# Altium schematic sheet StepDown.SchDoc
size B; SheetNumber: 10; SheetTotal: 15; SPICEModelCacheKQMKTCIF: <root> / <DocumentId>KQMKTCIF</DocumentId> / </root>
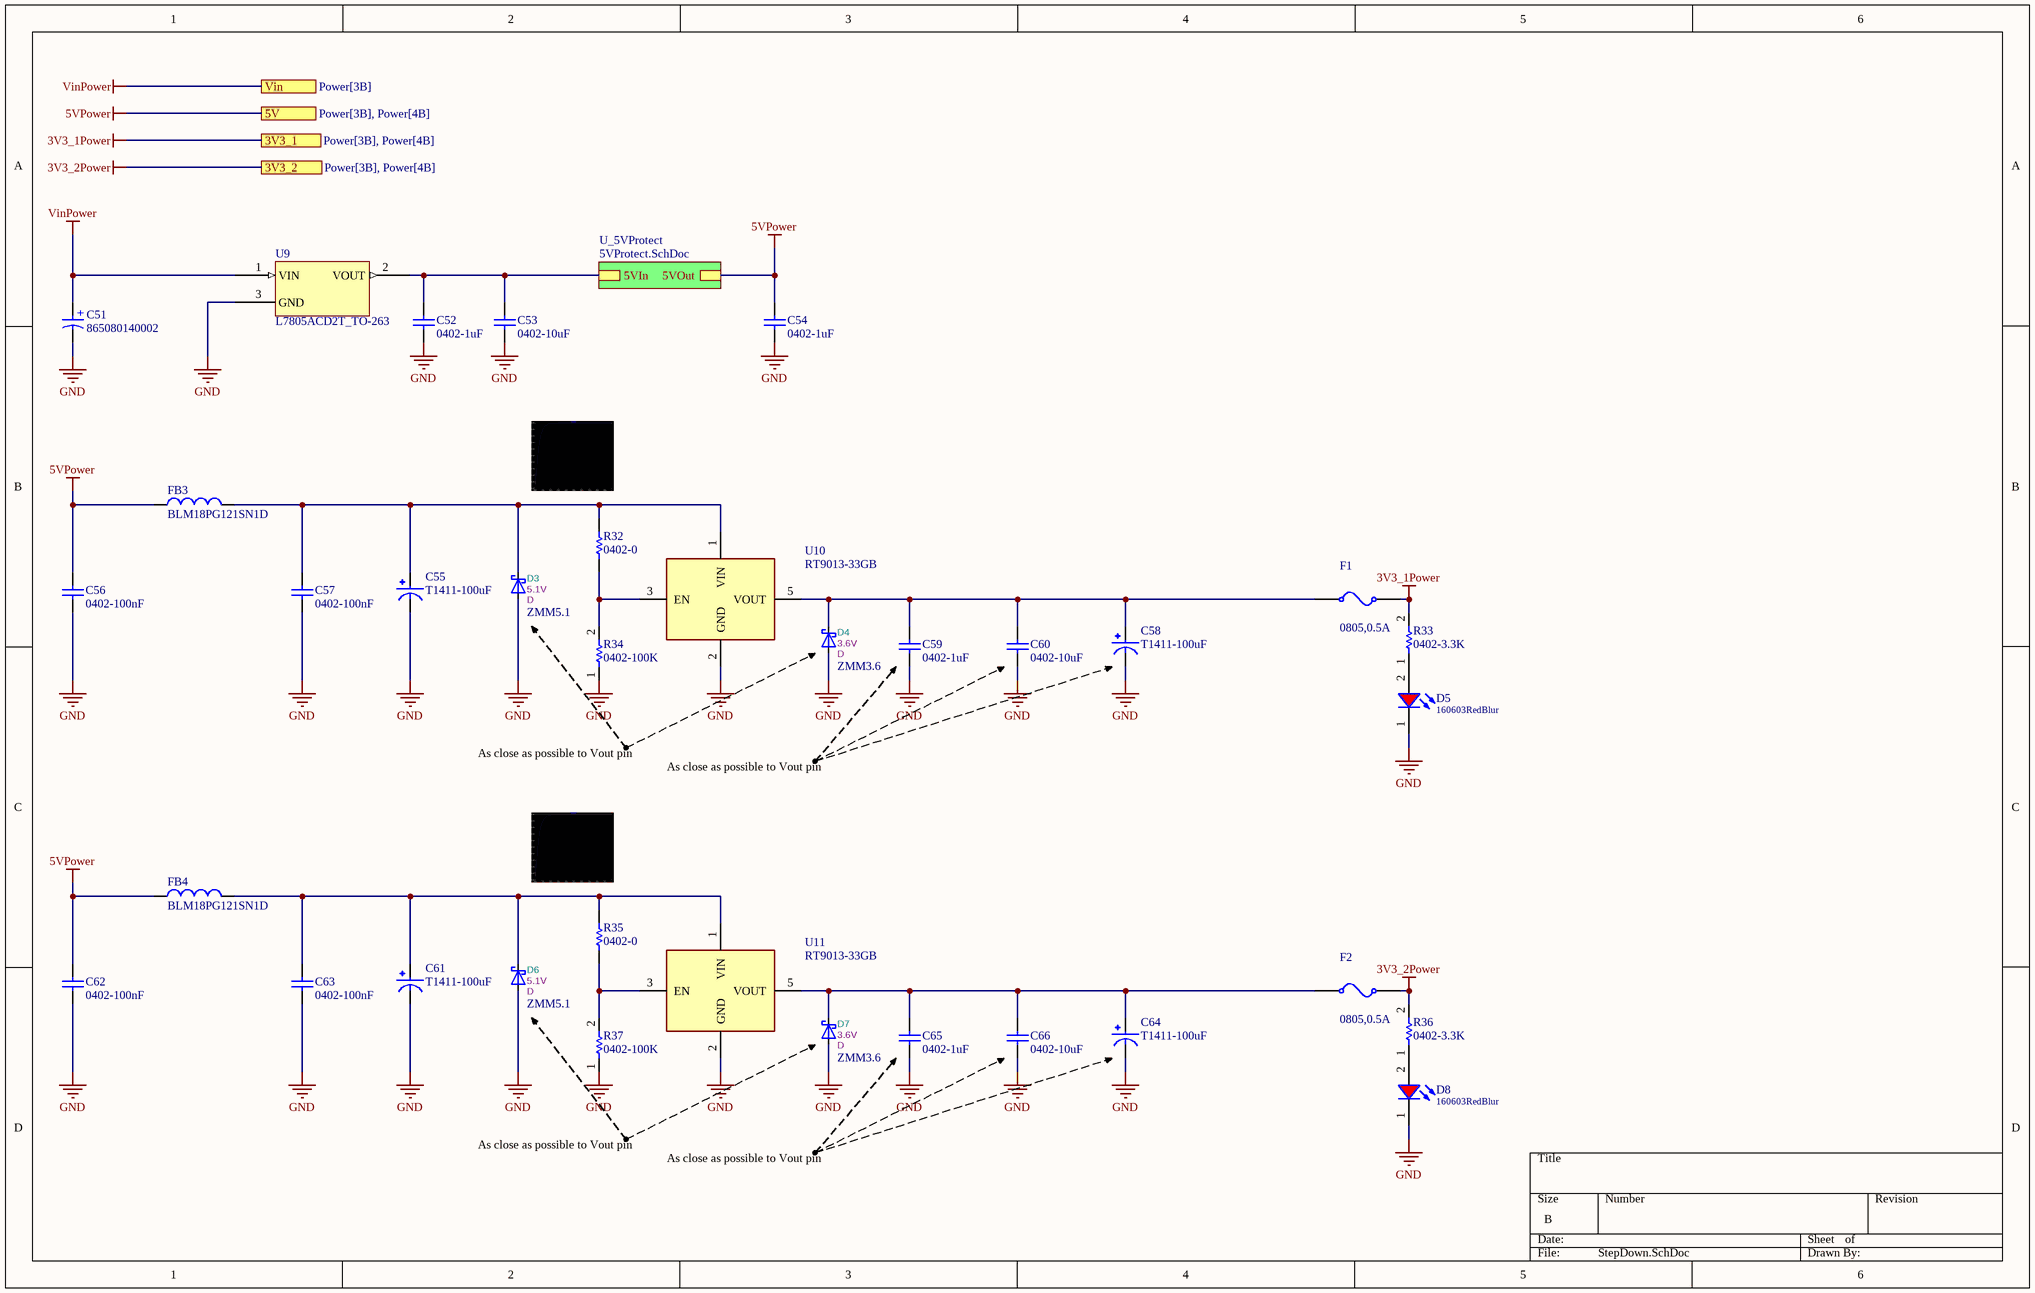
[diagram p0: StepDown.SchDoc]

## Parts
C51  865080140002  [WCAP-ASLI_D4H5.5]
C52  0402-1uF  [CAPC0402(1005)60_N]
C53  0402-10uF  [CAPC0402(1005)60_N]
C54  0402-1uF  [CAPC0402(1005)60_N]
C55  T1411-100uF  [CAPPC3528X210N]
C56  0402-100nF  [CAPC0402(1005)60_N]
C57  0402-100nF  [CAPC0402(1005)60_N]
C58  T1411-100uF  [CAPPC3528X210N]
C59  0402-1uF  [CAPC0402(1005)60_N]
C60  0402-10uF  [CAPC0402(1005)60_N]
C61  T1411-100uF  [CAPPC3528X210N]
C62  0402-100nF  [CAPC0402(1005)60_N]
C63  0402-100nF  [CAPC0402(1005)60_N]
C64  T1411-100uF  [CAPPC3528X210N]
C65  0402-1uF  [CAPC0402(1005)60_N]
C66  0402-10uF  [CAPC0402(1005)60_N]
D3  ZMM5.1  value 5.1V  Reference: D  [SOD-80_MiniMELF_Glass]
D4  ZMM3.6  value 3.6V  Reference: D  [SOD-80_MiniMELF_Glass]
D5  160603RedBlur  [WL-SMCW_0603_H=0.7mm]
D6  ZMM5.1  value 5.1V  Reference: D  [SOD-80_MiniMELF_Glass]
D7  ZMM3.6  value 3.6V  Reference: D  [SOD-80_MiniMELF_Glass]
D8  160603RedBlur  [WL-SMCW_0603_H=0.7mm]
F1  0805,0.5A  [Fuse_SMD_0805]
F2  0805,0.5A  [Fuse_SMD_0805]
FB3  BLM18PG121SN1D  [FP-BLM18-0_15-t0_8-MFG]
FB4  BLM18PG121SN1D  [FP-BLM18-0_15-t0_8-MFG]
R32  0402-0  [R-0402-1K]
R33  0402-3.3K  [R-0402-10K]
R34  0402-100K  [R-0402-10K]
R35  0402-0  [R-0402-1K]
R36  0402-3.3K  [R-0402-10K]
R37  0402-100K  [R-0402-10K]
U9  L7805ACD2T_TO-263  [TO-263]
U10  RT9013-33GB  [SOT94P279X129-5N]
U11  RT9013-33GB  [SOT94P279X129-5N]

## Sub-sheets
U_5VProtect = 5VProtect.SchDoc: 5VIn, 5VOut

## Ports
3V3_1 (see Power[3B], Power[4B]), 3V3_2 (see Power[3B], Power[4B]), 5V (see Power[3B], Power[4B]), Vin (see Power[3B])

## Nets
3V3_1Power: F1.1 R33.2 ; port 3V3_1
3V3_2Power: F2.1 R36.2 ; port 3V3_2
5VPower: C54.2 C56.2 C62.2 FB3.1 FB4.1 ; port 5V, sheet U_5VProtect/5VOut
GND: C51.2(N) C52.1 C53.1 C54.1 C55.2 C56.1 C57.1 C58.2 C59.1 C60.1 C61.2 C62.1 C63.1 C64.2 C65.1 C66.1 D3.A D4.A D5.1(K) D6.A D7.A D8.1(K) R34.1 R37.1 U9.3(GND) U10.2(GND) U11.2(GND)
VinPower: C51.1(P) U9.1(VIN) ; port Vin
NetC52_2: C52.2 C53.2 U9.2(VOUT) ; sheet U_5VProtect/5VIn
NetC55_1: C55.1 C57.2 D3.K FB3.2 R32.2 U10.1(VIN)
NetC58_1: C58.1 C59.2 C60.2 D4.K F1.0 U10.5(VOUT)
NetC61_1: C61.1 C63.2 D6.K FB4.2 R35.2 U11.1(VIN)
NetC64_1: C64.1 C65.2 C66.2 D7.K F2.0 U11.5(VOUT)
NetD5_2: D5.2(A) R33.1
NetD8_2: D8.2(A) R36.1
NetR32_1: R32.1 R34.2 U10.3(EN)
NetR35_1: R35.1 R37.2 U11.3(EN)

## Notes on the sheet
- As close as possible to Vout pin
- (in symbol CMP-014-00008-1) +

## Library data of the parts
C51 = CMP-014-00008-1: V-Chip, D4 x H5.8mm, 47uF, 6.3V; Manufacturer: Wurth Elektronik; Endurance: 2000h; Leakage Current: 3uA; Ripple Current: 86mA; Dissipation Factor: 24%; Capacitance Tolerance: +/-20%; Capacitance: 47µF; Pins: 2; Supplier 2 URL: N/A; Diameter: 4mm; Design Item ID: 865080140002; Supplier 1 SN: 710-865080140002; Operating Temperature Max: 105°C; Supplier 1 Name: Mouser; Source: Al_Cap.SchLib; Packaging: Tape and Reel; Supplier 2 Name: Digi-Key; Supplier 3 Name: thegioiic; Manufacturer Part Number: N/A; Supplier 2 SN: N/A; Rated Voltage (DC): 6.3V; Height: 5.5mm; Operating Temperature Min: -55°C; Value: 47uF, 6.3V; Supplier 1 URL: https://www.mouser.vn/ProductDetail/Wurth-Elektronik/865080140002?qs=0KOYDY2FL2%252BjKlezJ2boQA%3D%3D; Supplier 3 URL: https://www.thegioiic.com/tu-nhom-smd-47uf-6-3v-5x5-4mm; Category: Aluminum Electrolytic Capacitors; Mount: Surface Mount; Supplier 3 SN: EEEHB0J330AR; Component Type: Standard
C52 C54 C59 C65 = CMP-001-00353-3: Capacitor 1uF 0402s; Voltage Rating: 4V; Value: 1µF; Tolerance: 20%; Dielectric: X5R; Pins: 2; Component Type: Standard; Packaging: Tape and Reel; Min Operating Temperature: -55°C; Voltage Rating (DC): 4V; Series: M; Height: 0.5mm; RoHS Compliant: Yes; Case/Package: 0402; Thickness: 0.028inch; Design Item ID: CMP-1034-02139-2; Length: 0.039inch; Max Operating Temperature: 85°C; Termination: SMD/SMT; Package Quantity: 1; Width: 0.02inch; Halogen Free: Halogen Free; Source: 0402-10uF.SchLib; Construction: Flat; Mount: Surface Mount; Case Code (Metric): 1005
C53 C60 C66 = CMP-001-00352-3: Capacitor 10uF 0402s; Tolerance: 20%; Value: 10µF; Dielectric: X5R; Voltage Rating (DC): 4V; Width: 0.02inch; Packaging: Tape and Reel; RoHS Compliant: Yes; Series: M; Mount: Surface Mount; Termination: SMD/SMT; Source: 0402-10uF.SchLib; Design Item ID: CMP-1034-02139-2; Min Operating Temperature: -55°C; Construction: Flat; Component Type: Standard; Case Code (Metric): 1005; Length: 0.039inch; Height: 0.5mm; Pins: 2; Thickness: 0.028inch; Voltage Rating: 4V; Package Quantity: 1; Max Operating Temperature: 85°C; Halogen Free: Halogen Free; Case/Package: 0402
C55 C58 C61 C64 = CMP-001-00373-1: 100µF Molded Tantalum Polymer Capacitor 25 V 1411 (3528 Metric), 1210 150mOhm @ 100kHz; MF: AVX; MP: TCJB106M025R0150; Check_prices: https://www.snapeda.com/parts/TCJB106M025R0150/AVX/view-part/?ref=eda; Component Type: Standard; Value: 100µF; SnapEDA_Link: https://www.snapeda.com/parts/TCJB106M025R0150/AVX/view-part/?ref=snap; Pins: 2; Case/Package: 1210 AVX; Design Item ID: TCJB106M025R0150; Source: TCJB106M025R0150.SchLib
C56 C57 C62 C63 = CMP-001-00354-3: Capacitor 100nF 0402; Tolerance: 20%; Voltage Rating (DC): 4V; Dielectric: X5R; Series: M; RoHS Compliant: Yes; Max Operating Temperature: 85°C; Length: 0.039inch; Thickness: 0.028inch; Mount: Surface Mount; Min Operating Temperature: -55°C; Height: 0.5mm; Packaging: Tape and Reel; Construction: Flat; Termination: SMD/SMT; Source: 0402-10uF.SchLib; Design Item ID: CMP-1034-02139-2; Case/Package: 0402; Voltage Rating: 4V; Pins: 2; Value: 100nF; Width: 0.02inch; Component Type: Standard; Package Quantity: 1; Halogen Free: Halogen Free; Case Code (Metric): 1005
D3 D6 = CMP-004-00117-3: ki_keywords: Zener; Design Item ID: Zener; Pins: 2; Datasheet: https://diotec.com/de/produktliste/SBD.html; Component Type: Standard; Source: schottky-diode.SchLib; ki_description: Zener
D4 D7 = CMP-004-00123-1: ZenerDiode 3.6V; ki_description: Zener; Pins: 2; Design Item ID: Zener; Component Type: Standard; Source: schottky-diode.SchLib; ki_keywords: Zener; Datasheet: https://diotec.com/de/produktliste/SBD.html
D5 D8 = CMP-004-00093-1: WL-SMCW SMT Mono-color Chip LED Blur, size 0603, Red, 2V, 140deg; Value: Red, 2V; ComponentLink2URL: https://www.mouser.vn/ProductDetail/ROHM-Semiconductor/CSL1901VW1?qs=vvQtp7zwQdNmrXZcE27xEA%3D%3D; Supplier 2 URL: https://www.digikey.com/en/products/detail/rohm-semiconductor/SML-D12U8WT86/1641799; Pins: 2; Supplier 2 Name: Digi-Key; ComponentLink1Description: Datasheet link; ComponentLink3URL: https://www.digikey.com/en/products/detail/rohm-semiconductor/SML-D12U8WT86/1641799; Supplier 1 Name: Mouser; Supplier 1 SN: 755-CSL1901VW1; Size: 0603; ComponentLink1URL: N/A; Source: WL-SMCW_0603.SchLib; ComponentLink3Description: Supplier 2 URL; Type: Blur; Design Item ID: 160603RedBlur; Component Type: Standard; ComponentLink4URL: N/A; Supplier 3 Name: ICDayRoi; Supplier 3 SN: N/A; Color: Red; Supplier 1 URL: https://www.mouser.vn/ProductDetail/ROHM-Semiconductor/CSL1901VW1?qs=vvQtp7zwQdNmrXZcE27xEA%3D%3D; Supplier 2 SN: 511-1580-2-ND; ComponentLink2Description: Supplier 1 URL; Supplier 3 URL: N/A; ComponentLink4Description: Supplier 3 URL
F1 F2 = CMP-005-00046-1: Resettable Fuse, Size 0805, 6V, 0.5A; Manufacturer: Littelfuse; Threshold Current: 100A; Trip Current: 1A; Supplier 1 Name: Mouser; ComponentLink3URL: https://www.digikey.com/en/products/detail/littelfuse-inc/0805L050WR/1212822?s=N4IgTCBcDaIAwA44FYAyK4HUBKACEAugL5A; Component Type: Standard; Design Item ID: 060805050006; ComponentLink1Description: Datasheet link; ComponentLink2Description: Supplier 1 URL; Supplier 2 Name: Digi-Key; ComponentLink4URL: https://www.thegioiic.com/0805l050wr-cau-chi-tu-phuc-hoi-0805-6v-500ma; Size: 0805; Hold Current: 0.5A; Supplier 2 URL: https://www.mouser.vn/ProductDetail/Littelfuse/0805L050WR?qs=SJZ%252BTX%252BI2BS1ufZ22HRodg%3D%3D; Supplier 2 SN: F2772TR-ND; Threshold Voltage: 6V; ComponentLink4Description: Supplier 3 URL; Source: Fuse_SMD.SchLib; Supplier 3 SN: 0805L050WR; ComponentLink3Description: Supplier 2 URL; Mounting Technology: SMT/SMD; Supplier 3 Name: thegioiic; ComponentLink1URL: https://www.littelfuse.com/~/media/electronics/datasheets/resettable_ptcs/littelfuse_ptc_0805l_datasheet.pdf.pdf; Supplier 3 URL: https://www.thegioiic.com/0805l050wr-cau-chi-tu-phuc-hoi-0805-6v-500ma; Supplier 1 SN: 576-0805L050; ComponentLink2URL: https://www.mouser.vn/ProductDetail/Littelfuse/0805L050WR?qs=SJZ%252BTX%252BI2BS1ufZ22HRodg%3D%3D; Supplier 1 URL: https://www.mouser.vn/ProductDetail/Littelfuse/0805L050WR?qs=SJZ%252BTX%252BI2BS1ufZ22HRodg%3D%3D; Value: 6V,  0.5A; Pins: 2
FB3 FB4 = CMP-006-00234-2: Ferrite Chip, 1 Function(s), 2A, 2 Pin(s); DC Resistance-Max: 50mR; Max Operating Temperature: 125°C; Packaging: Tape and Reel; Material: Ferrite; Min Operating Temperature: -55°C; RoHS Compliant: Yes; Current Rating: 2A; Height: 0.8mm; Length: 1.6mm; Width: 0.8mm
R32 R35 = CMP-009-00678-4: 0402Resistor 0 Ohm; Value: 0
R33 R36 = CMP-009-00688-1: RES 0402 3.3K; Value: 3.3k
R34 R37 = CMP-009-00683-1: RES 0402 100K; Value: 100k
U9 = CMP-098-000007-1: Out: 5V, 1.5A; In: 7V to 35V; Pacakge: TO-263; Supplier 2 URL: https://www.digikey.com/en/products/detail/stmicroelectronics/L7805ACD2T-TR/1038230; Supplier 2 SN: 497-7253-2-ND; Package: TO-263; Component Type: Standard; Voltage Input Maximum: 7V to 35V; Output Current: 1.5A; Design Item ID: L7805ACD2T_TO-263; Supplier 3 SN: N/A; ComponentLink4Description: Supplier 3 URL; ComponentLink4URL: https://www.thegioiic.com/l7805acd2t-ic-on-ap-5v-1-5a; Supplier 1 URL: https://www.mouser.com/ProductDetail/STMicroelectronics/L7805ACD2T-TR?qs=Ctxo64yJVFuOLXlPPZdJUQ%3D%3D; Supplier 3 URL: https://www.thegioiic.com/l7805acd2t-ic-on-ap-5v-1-5a; Value: 5V, 1.5A; Pin Count: 3; Supplier 2 Name: Digi-Key; ComponentLink1Description: Datasheet link; Voltage Output: 5V; ComponentLink3Description: Supplier 2 URL; Supplier 1 SN: 511-L7805ACD2T-TR; ComponentLink3URL: https://www.digikey.com/en/products/detail/stmicroelectronics/L7805ACD2T-TR/1038230; Supplier 3 Name: thegioiic; ComponentLink2URL: https://www.mouser.com/ProductDetail/STMicroelectronics/L7805ACD2T-TR?qs=Ctxo64yJVFuOLXlPPZdJUQ%3D%3D; Source: 78xx.SchLib; ComponentLink2Description: Supplier 1 URL; Supplier 1 Name: Mouser; ComponentLink1URL: https://www.st.com/resource/en/datasheet/l78.pdf
U10 U11 = CMP-149-000001-2: Linear Voltage Regulator IC Positive Fixed 1 Output 500mA TSOT-23-5; MF: Richtek USA; Design Item ID: RT9013-33GB; SnapEDA_Link: https://www.snapeda.com/parts/RT9013-33GB/Richtek/view-part/?ref=snap; Source: RT9013-33GB.SchLib; Component Type: Standard; Pin Count: 4; Check_prices: https://www.snapeda.com/parts/RT9013-33GB/Richtek/view-part/?ref=eda; MP: RT9013-33GB; Package: SOT-23-5 Richtek; Value: *